# EasyEDA Pro project Dennis_Re.eprj, board PCB1
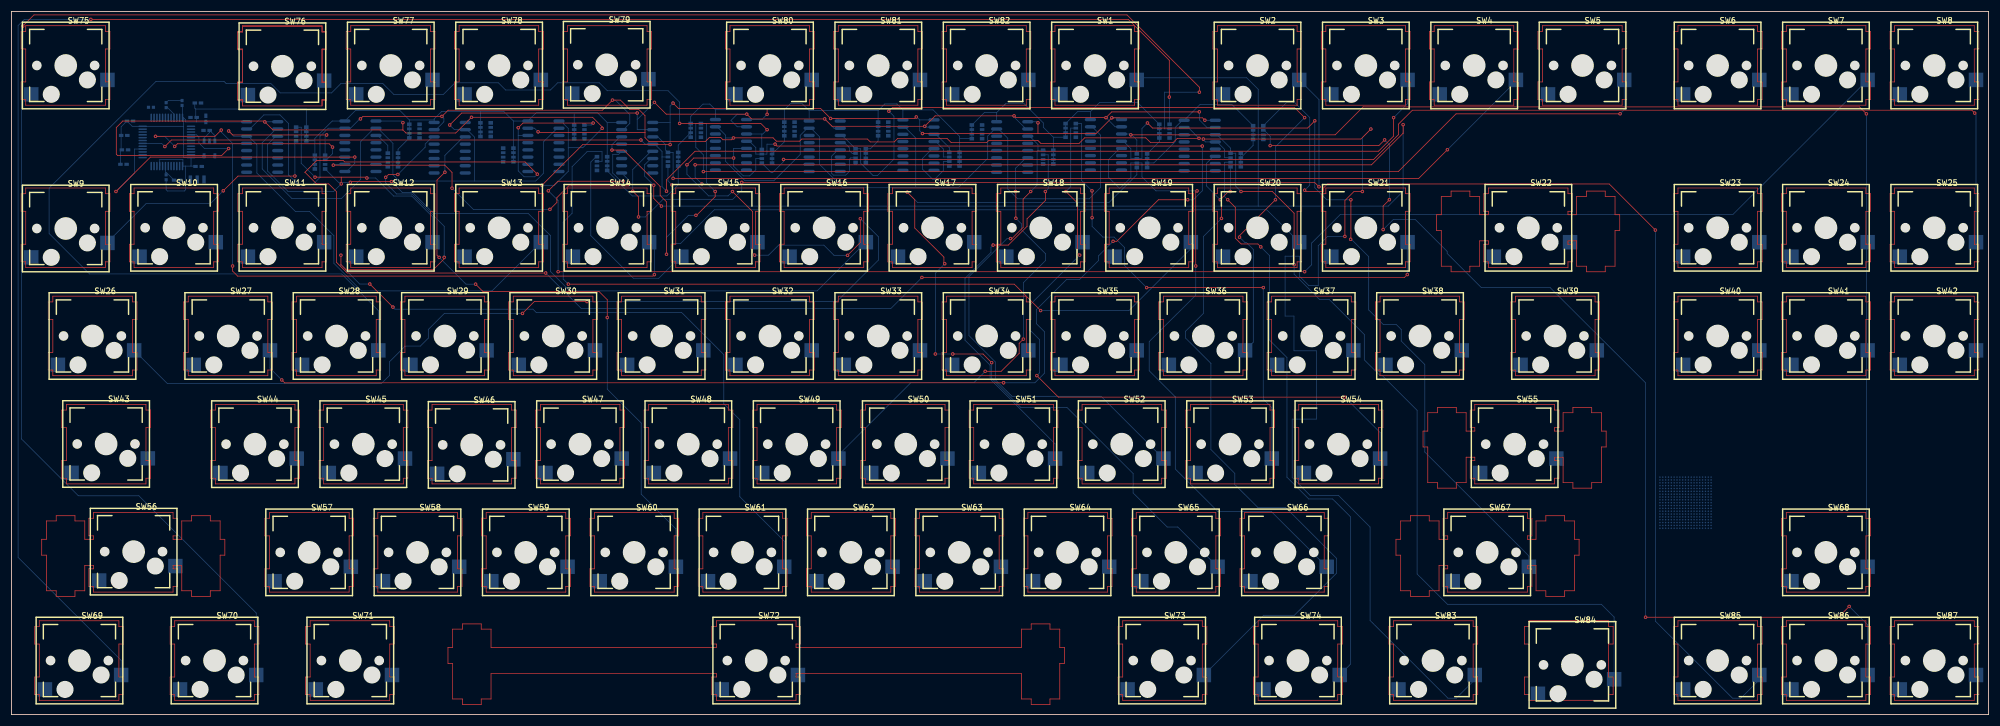
[diagram p3: board, top side]
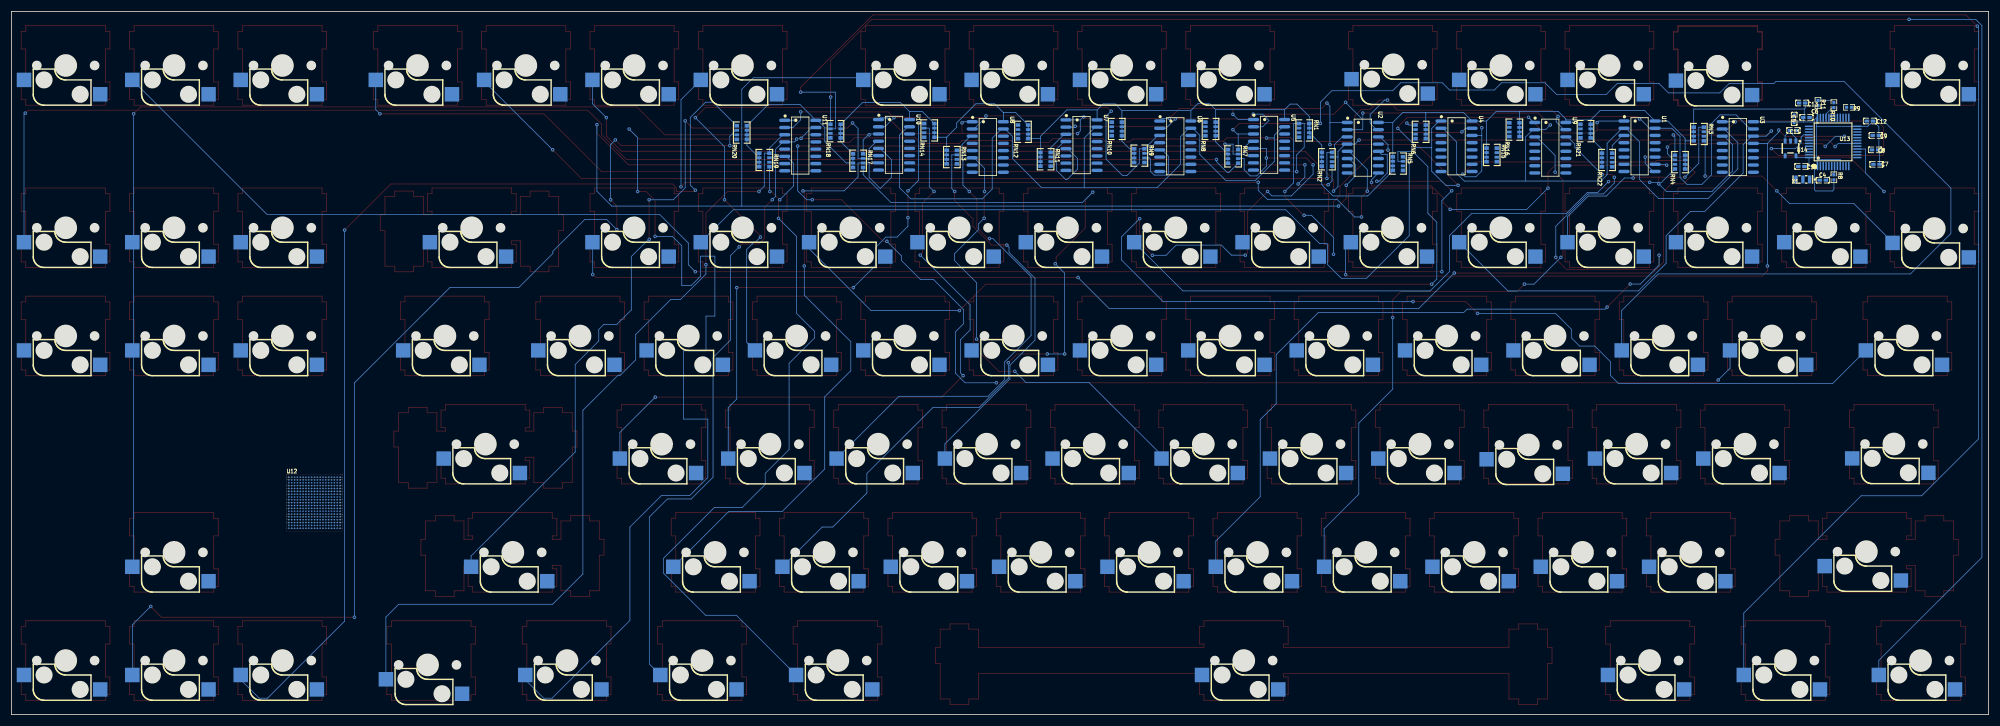
[diagram p4: board, bottom side, seen from below]

Outline 347.66 x 123.83 mm; copper layers: Top Layer, Bottom Layer. Coordinates in mm from the lower left corner of the outline.
Outline path: rectangle 0,123.83 347.66,0
Stack: Top Layer 0.035mm / Dielectric1 1.51mm FR4 er 4.5 / 二层 1.51mm FR4 er 4.5 / 三层 1.51mm FR4 er 4.5 / Bottom Layer 0.035mm

## Design rules (mm)
spacing safeClearance (default): track to track 0.152, other pairs 0.152 to 0.3
track width trackWidth (default): min 0.127, default 0.254, max 2.54
differential pair differentialPair (default): width min 0.127, default 0.254, max 2.54; gap min 0.152, default 0.152
via viaSize (default): diameter min 0.5, default 0.61, max 10; hole min 0.3, default 0.305, max 6

## Placement (name value [footprint] x y rotation side)
C4  100nF  [C0402]  29.15 94.1 180 bottom
C5  100nF  [C0402]  34.2 104.9 270 bottom
C6  100nF  [C0402]  32.04 105.15 0 bottom
C7  100nF  [C0402]  19.72 96.9 180 bottom
C8  100nF  [C0402]  19.97 99.44 180 bottom
C9  10uF  [C0402]  19.84 101.98 180 bottom
C10  100nF  [C0402]  32.92 96.52 180 bottom
C11  10uF  [C0402]  34.32 102.87 180 bottom
C12  10uF  [C0402]  20.86 104.52 180 bottom
C13  100nF  [C0402]  32.8 107.69 180 bottom
R8  10kΩ  [R0402]  27.21 94.61 270 bottom
R9  22Ω  [R0402]  24.54 106.93 180 bottom
R10  22Ω  [R0402]  27.21 107.31 90 bottom
R11  1.5kΩ  [R0402]  30 107.69 270 bottom
RN1  10kΩ  [RES-ARRAY-SMD_0603-8P-L3.2-W1.6-BL]  120.35 102.87 270 bottom
RN2  10kΩ  [RES-ARRAY-SMD_0603-8P-L3.2-W1.6-BL]  116.35 97.79 90 bottom
RN3  10kΩ  [RES-ARRAY-SMD_0603-8P-L3.2-W1.6-BL]  50.96 102.23 270 bottom
RN4  10kΩ  [RES-ARRAY-SMD_0603-8P-L3.2-W1.6-BL]  54.26 97.28 90 bottom
RN5  10kΩ  [RES-ARRAY-SMD_0603-8P-L3.2-W1.6-BL]  103.86 97.02 270 bottom
RN6  10kΩ  [RES-ARRAY-SMD_0603-8P-L3.2-W1.6-BL]  99.86 102.61 90 bottom
RN7  10kΩ  [RES-ARRAY-SMD_0603-8P-L3.2-W1.6-BL]  132.85 98.29 270 bottom
RN8  10kΩ  [RES-ARRAY-SMD_0603-8P-L3.2-W1.6-BL]  136.81 103.12 90 bottom
RN9  10kΩ  [RES-ARRAY-SMD_0603-8P-L3.2-W1.6-BL]  149.34 98.42 270 bottom
RN10  10kΩ  [RES-ARRAY-SMD_0603-8P-L3.2-W1.6-BL]  153.3 103.12 90 bottom
RN11  10kΩ  [RES-ARRAY-SMD_0603-8P-L3.2-W1.6-BL]  165.82 97.79 270 bottom
RN12  10kΩ  [RES-ARRAY-SMD_0603-8P-L3.2-W1.6-BL]  169.78 102.61 90 bottom
RN13  10kΩ  [RES-ARRAY-SMD_0603-8P-L3.2-W1.6-BL]  182.31 98.17 270 bottom
RN14  10kΩ  [RES-ARRAY-SMD_0603-8P-L3.2-W1.6-BL]  186.26 102.87 90 bottom
RN15  10kΩ  [RES-ARRAY-SMD_0603-8P-L3.2-W1.6-BL]  87.38 98.55 270 bottom
RN16  10kΩ  [RES-ARRAY-SMD_0603-8P-L3.2-W1.6-BL]  83.38 102.99 90 bottom
RN17  10kΩ  [RES-ARRAY-SMD_0603-8P-L3.2-W1.6-BL]  198.79 97.53 270 bottom
RN18  10kΩ  [RES-ARRAY-SMD_0603-8P-L3.2-W1.6-BL]  202.75 102.74 90 bottom
RN19  10kΩ  [RES-ARRAY-SMD_0603-8P-L3.2-W1.6-BL]  215.28 97.66 270 bottom
RN20  10kΩ  [RES-ARRAY-SMD_0603-8P-L3.2-W1.6-BL]  219.23 102.49 90 bottom
RN21  10kΩ  [RES-ARRAY-SMD_0603-8P-L3.2-W1.6-BL]  70.87 102.74 90 bottom
RN22  10kΩ  [RES-ARRAY-SMD_0603-8P-L3.2-W1.6-BL]  67.09 97.66 90 bottom
SW1  -  [轴座_焊接热插拔_不带灯]  190.53 114.3 0 top
SW2  -  [轴座_焊接热插拔_不带灯]  219.11 114.3 0 top
SW3  -  [轴座_焊接热插拔_不带灯]  238.16 114.3 0 top
SW4  -  [轴座_焊接热插拔_不带灯]  257.21 114.3 0 top
SW5  -  [轴座_焊接热插拔_不带灯]  276.26 114.3 0 top
SW6  -  [轴座_焊接热插拔_不带灯]  300.01 114.3 0 top
SW7  -  [轴座_焊接热插拔_不带灯]  319.06 114.3 0 top
SW8  -  [轴座_焊接热插拔_不带灯]  338.11 114.3 0 top
SW9  -  [轴座_焊接热插拔_不带灯]  9.56 85.59 0 top
SW10  -  [轴座_焊接热插拔_不带灯]  28.61 85.72 0 top
SW11  -  [轴座_焊接热插拔_不带灯]  47.66 85.72 0 top
SW12  -  [轴座_焊接热插拔_不带灯]  66.71 85.72 0 top
SW13  -  [轴座_焊接热插拔_不带灯]  85.76 85.72 0 top
SW14  -  [轴座_焊接热插拔_不带灯]  104.81 85.72 0 top
SW15  -  [轴座_焊接热插拔_不带灯]  123.86 85.72 0 top
SW16  -  [轴座_焊接热插拔_不带灯]  142.91 85.72 0 top
SW17  -  [轴座_焊接热插拔_不带灯]  161.96 85.72 0 top
SW18  -  [轴座_焊接热插拔_不带灯]  181.01 85.72 0 top
SW19  -  [轴座_焊接热插拔_不带灯]  200.06 85.72 0 top
SW20  -  [轴座_焊接热插拔_不带灯]  219.11 85.72 0 top
SW21  -  [轴座_焊接热插拔_不带灯]  238.16 85.72 0 top
SW22  -  [轴座_焊接热插拔_不带灯]  266.73 85.72 0 top
SW23  -  [轴座_焊接热插拔_不带灯]  300.01 85.72 0 top
SW24  -  [轴座_焊接热插拔_不带灯]  319.06 85.72 0 top
SW25  -  [轴座_焊接热插拔_不带灯]  338.11 85.72 0 top
SW26  -  [轴座_焊接热插拔_不带灯]  14.26 66.67 0 top
SW27  -  [轴座_焊接热插拔_不带灯]  38.13 66.67 0 top
SW28  -  [轴座_焊接热插拔_不带灯]  57.18 66.67 0 top
SW29  -  [轴座_焊接热插拔_不带灯]  76.23 66.67 0 top
SW30  -  [轴座_焊接热插拔_不带灯]  95.28 66.67 0 top
SW31  -  [轴座_焊接热插拔_不带灯]  114.33 66.67 0 top
SW32  -  [轴座_焊接热插拔_不带灯]  133.38 66.67 0 top
SW33  -  [轴座_焊接热插拔_不带灯]  152.43 66.67 0 top
SW34  -  [轴座_焊接热插拔_不带灯]  171.48 66.67 0 top
SW35  -  [轴座_焊接热插拔_不带灯]  190.53 66.67 0 top
SW36  -  [轴座_焊接热插拔_不带灯]  209.58 66.67 0 top
SW37  -  [轴座_焊接热插拔_不带灯]  228.63 66.67 0 top
SW38  -  [轴座_焊接热插拔_不带灯]  247.68 66.67 0 top
SW39  -  [轴座_焊接热插拔_不带灯]  271.43 66.67 0 top
SW40  -  [轴座_焊接热插拔_不带灯]  300.01 66.67 0 top
SW41  -  [轴座_焊接热插拔_不带灯]  319.06 66.67 0 top
SW42  -  [轴座_焊接热插拔_不带灯]  338.11 66.67 0 top
SW43  -  [轴座_焊接热插拔_不带灯]  16.66 47.66 0 top
SW44  -  [轴座_焊接热插拔_不带灯]  42.83 47.62 0 top
SW45  -  [轴座_焊接热插拔_不带灯]  61.88 47.62 0 top
SW46  -  [轴座_焊接热插拔_不带灯]  80.93 47.49 0 top
SW47  -  [轴座_焊接热插拔_不带灯]  99.98 47.62 0 top
SW48  -  [轴座_焊接热插拔_不带灯]  119.03 47.62 0 top
SW49  -  [轴座_焊接热插拔_不带灯]  138.08 47.62 0 top
SW50  -  [轴座_焊接热插拔_不带灯]  157.26 47.62 0 top
SW51  -  [轴座_焊接热插拔_不带灯]  176.18 47.62 0 top
SW52  -  [轴座_焊接热插拔_不带灯]  195.23 47.62 0 top
SW53  -  [轴座_焊接热插拔_不带灯]  214.28 47.62 0 top
SW54  -  [轴座_焊接热插拔_不带灯]  233.33 47.62 0 top
SW55  -  [轴座_焊接热插拔_不带灯]  264.32 47.62 0 top
SW56  -  [轴座_焊接热插拔_不带灯]  21.49 28.7 0 top
SW57  -  [轴座_焊接热插拔_不带灯]  52.36 28.57 0 top
SW58  -  [轴座_焊接热插拔_不带灯]  71.41 28.57 0 top
SW59  -  [轴座_焊接热插拔_不带灯]  90.46 28.57 0 top
SW60  -  [轴座_焊接热插拔_不带灯]  109.51 28.57 0 top
SW61  -  [轴座_焊接热插拔_不带灯]  128.56 28.57 0 top
SW62  -  [轴座_焊接热插拔_不带灯]  147.61 28.57 0 top
SW63  -  [轴座_焊接热插拔_不带灯]  166.66 28.57 0 top
SW64  -  [轴座_焊接热插拔_不带灯]  185.71 28.57 0 top
SW65  -  [轴座_焊接热插拔_不带灯]  204.76 28.57 0 top
SW66  -  [轴座_焊接热插拔_不带灯]  223.93 28.57 0 top
SW67  -  [轴座_焊接热插拔_不带灯]  259.49 28.57 0 top
SW68  -  [轴座_焊接热插拔_不带灯]  319.06 28.57 0 top
SW69  -  [轴座_焊接热插拔_不带灯]  11.97 9.52 0 top
SW70  -  [轴座_焊接热插拔_不带灯]  35.72 9.52 0 top
SW71  -  [轴座_焊接热插拔_不带灯]  59.59 9.52 0 top
SW72  -  [轴座_焊接热插拔_不带灯]  130.97 9.52 0 top
SW73  -  [轴座_焊接热插拔_不带灯]  202.34 9.52 0 top
SW74  -  [轴座_焊接热插拔_不带灯]  226.22 9.52 0 top
SW75  -  [轴座_焊接热插拔_不带灯]  9.56 114.3 0 top
SW76  -  [轴座_焊接热插拔_不带灯]  47.66 114.17 0 top
SW77  -  [轴座_焊接热插拔_不带灯]  66.71 114.3 0 top
SW78  -  [轴座_焊接热插拔_不带灯]  85.76 114.3 0 top
SW79  -  [轴座_焊接热插拔_不带灯]  104.68 114.42 0 top
SW80  -  [轴座_焊接热插拔_不带灯]  133.38 114.3 0 top
SW81  -  [轴座_焊接热插拔_不带灯]  152.43 114.3 0 top
SW82  -  [轴座_焊接热插拔_不带灯]  171.48 114.3 0 top
SW83  -  [轴座_焊接热插拔_不带灯]  249.97 9.52 0 top
SW84  -  [轴座_焊接热插拔_不带灯]  274.48 8.76 0 top
SW85  -  [轴座_焊接热插拔_不带灯]  300.01 9.52 0 top
SW86  -  [轴座_焊接热插拔_不带灯]  319.06 9.52 0 top
SW87  -  [轴座_焊接热插拔_不带灯]  338.11 9.52 0 top
U1  -  [SOIC-16_L9.9-W3.9-P1.27-LS6.0-BL]  61.37 100.07 270 bottom
U2  -  [SOIC-16_L9.9-W3.9-P1.27-LS6.0-BL]  110.04 99.82 270 bottom
U3  -  [SOIC-16_L9.9-W3.9-P1.27-LS6.0-BL]  44.1 99.95 270 bottom
U4  -  [SOIC-16_L9.9-W3.9-P1.27-LS6.0-BL]  93.56 100.07 270 bottom
U5  -  [SOIC-16_L9.9-W3.9-P1.27-LS6.0-BL]  126.52 100.33 270 bottom
U6  -  [SOIC-16_L9.9-W3.9-P1.27-LS6.0-BL]  143.01 100.07 270 bottom
U7  -  [SOIC-16_L9.9-W3.9-P1.27-LS6.0-BL]  159.49 100.27 270 bottom
U8  -  [SOIC-16_L9.9-W3.9-P1.27-LS6.0-BL]  175.98 99.95 270 bottom
U9  -  [SOIC-16_L9.9-W3.9-P1.27-LS6.0-BL]  77.07 99.82 270 bottom
U10  -  [SOIC-16_L9.9-W3.9-P1.27-LS6.0-BL]  192.46 100.33 270 bottom
U11  -  [SOIC-16_L9.9-W3.9-P1.27-LS6.0-BL]  208.95 100.2 270 bottom
U12  VL830  [New_Library:VL830]  294.42 37.59 180 bottom
U13  -  [LQFP-48_L7.0-W7.0-P0.50-LS9.0-BL]  27.34 100.83 180 bottom
U14  -  [SOT-25_L3.0-W1.6-P0.95-LS2.8-BL]  34.83 99.69 0 bottom
X1  8MHz  [OSC-SMD_3P-L3.2-W1.3-P1.20-L]  32.67 94.23 0 bottom

## Footprints (pads in the part's own frame, mm; a bottom-side part is the same pattern mirrored in y, then rotated)
C0402
  rect 0.79x0.54 smd: 1(-0.545,0) 2(0.545,0)
LQFP-48_L7.0-W7.0-P0.50-LS9.0-BL
  oval 0.27x1.5 smd: 1(-2.75,-4.25) 2(-2.25,-4.25) 3(-1.75,-4.25) 4(-1.25,-4.25) 5(-0.75,-4.25) 6(-0.25,-4.25) 7(0.25,-4.25) 8(0.75,-4.25) 9(1.25,-4.25) 10(1.75,-4.25) 11(2.25,-4.25) 12(2.75,-4.25) 25(2.75,4.25) 26(2.25,4.25) 27(1.75,4.25) 28(1.25,4.25) 29(0.75,4.25) 30(0.25,4.25) 31(-0.25,4.25) 32(-0.75,4.25) 33(-1.25,4.25) 34(-1.75,4.25) 35(-2.25,4.25) 36(-2.75,4.25)
  oval 1.5x0.27 smd: 13(4.25,-2.75) 14(4.25,-2.25) 15(4.25,-1.75) 16(4.25,-1.25) 17(4.25,-0.75) 18(4.25,-0.25) 19(4.25,0.25) 20(4.25,0.75) 21(4.25,1.25) 22(4.25,1.75) 23(4.25,2.25) 24(4.25,2.75) 37(-4.25,2.75) 38(-4.25,2.25) 39(-4.25,1.75) 40(-4.25,1.25) 41(-4.25,0.75) 42(-4.25,0.25) 43(-4.25,-0.25) 44(-4.25,-0.75) 45(-4.25,-1.25) 46(-4.25,-1.75) 47(-4.25,-2.25) 48(-4.25,-2.75)
New_Library:VL830
  round 0.27 smd: 1(-4.45,4.23) 2(-3.95,4.23) 3(-3.45,4.23) 4(-2.95,4.23) 5(-2.45,4.23) 6(-1.95,4.23) 7(-1.45,4.23) 8(-0.95,4.23) 9(-0.45,4.23) 10(0.06,4.23) 11(0.55,4.23) 12(1.05,4.23) 13(1.55,4.23) 14(2.05,4.23) 15(2.55,4.23) 16(3.05,4.23) 17(3.55,4.23) 18(4.05,4.23) 19(4.55,4.23) 20(-4.45,3.73) 21(-3.95,3.73) 22(-3.45,3.73) 23(-2.95,3.73) 24(-2.45,3.73) 25(-1.95,3.73) 26(-1.45,3.73) 27(-0.95,3.73) 28(-0.45,3.73) 29(0.06,3.73) 30(0.55,3.73) 31(1.05,3.73) 32(1.55,3.73) 33(2.05,3.73) 34(2.55,3.73) 35(3.05,3.73) 36(3.55,3.73) 37(4.05,3.73) 38(4.55,3.73) 39(-4.45,3.23) 40(-3.95,3.23) 41(-3.45,3.23) 42(-2.95,3.23) 43(-2.45,3.23) 44(-1.95,3.23) 45(-1.45,3.23) 46(-0.95,3.23) 47(-0.45,3.23) 48(0.06,3.23) 49(0.55,3.23) 50(1.05,3.23) 51(1.55,3.23) 52(2.05,3.23) 53(2.55,3.23) 54(3.05,3.23) 55(3.55,3.23) 56(4.05,3.23) 57(4.55,3.23) 58(-4.45,2.73) 59(-3.95,2.73) 60(-3.45,2.73) 61(-2.95,2.73) 62(-2.45,2.73) 63(-1.95,2.73) 64(-1.45,2.73) 65(-0.95,2.73) 66(-0.45,2.73) 67(0.06,2.73) 68(0.55,2.73) 69(1.05,2.73) 70(1.55,2.73) 71(2.05,2.73) 72(2.55,2.73) 73(3.05,2.73) 74(3.55,2.73) 75(4.05,2.73) 76(4.55,2.73) 77(-4.45,2.23) 78(-3.95,2.23) 79(-3.45,2.23) 80(-2.95,2.23) 81(-2.45,2.23) 82(-1.95,2.23) 83(-1.45,2.23) 84(-0.95,2.23) 85(-0.45,2.23) 86(0.06,2.23) 87(0.55,2.23) 88(1.05,2.23) 89(1.55,2.23) 90(2.05,2.23) 91(2.55,2.23) 92(3.05,2.23) 93(3.55,2.23) 94(4.05,2.23) 95(4.55,2.23) 96(-4.45,1.73) 97(-3.95,1.73) 98(-3.45,1.73) 99(-2.95,1.73) 100(-2.45,1.73) 101(-1.95,1.73) 102(-1.45,1.73) 103(-0.95,1.73) 104(-0.45,1.73) 105(0.06,1.73) 106(0.55,1.73) 107(1.05,1.73) 108(1.55,1.73) 109(2.05,1.73) 110(2.55,1.73) 111(3.05,1.73) 112(3.55,1.73) 113(4.05,1.73) 114(4.55,1.73) 115(-4.45,1.23) 116(-3.95,1.23) 117(-3.45,1.23) 118(-2.95,1.23) 119(-2.45,1.23) 120(-1.95,1.23) 121(-1.45,1.23) 122(-0.95,1.23) 123(-0.45,1.23) 124(0.06,1.23) 125(0.55,1.23) 126(1.05,1.23) 127(1.55,1.23) 128(2.05,1.23) 129(2.55,1.23) 130(3.05,1.23) 131(3.55,1.23) 132(4.05,1.23) 133(4.55,1.23) 134(-4.45,0.73) 135(-3.95,0.73) 136(-3.45,0.73) 137(-2.95,0.73) 138(-2.45,0.73) 139(-1.95,0.73) 140(-1.45,0.73) 141(-0.95,0.73) 142(-0.45,0.73) 143(0.06,0.73) 144(0.55,0.73) 145(1.05,0.73) 146(1.55,0.73) 147(2.05,0.73) 148(2.55,0.73) 149(3.05,0.73) 150(3.55,0.73) 151(4.05,0.73) 152(4.55,0.73) 153(-4.45,0.23) 154(-3.95,0.23) 155(-3.45,0.23) 156(-2.95,0.23) 157(-2.45,0.23) 158(-1.95,0.23) 159(-1.45,0.23) 160(-0.95,0.23) 161(-0.45,0.23) 162(0.06,0.23) 163(0.55,0.23) 164(1.05,0.23) 165(1.55,0.23) 166(2.05,0.23) 167(2.55,0.23) 168(3.05,0.23) 169(3.55,0.23) 170(4.05,0.23) 171(4.55,0.23) 172(-4.45,-0.27) 173(-3.95,-0.27) 174(-3.45,-0.27) 175(-2.95,-0.27) 176(-2.45,-0.27) 177(-1.95,-0.27) 178(-1.45,-0.27) 179(-0.95,-0.27) 180(-0.45,-0.27) 181(0.06,-0.27) 182(0.55,-0.27) 183(1.05,-0.27) 184(1.55,-0.27) 185(2.05,-0.27) 186(2.55,-0.27) 187(3.05,-0.27) 188(3.55,-0.27) 189(4.05,-0.27) 190(4.55,-0.27) 191(-4.45,-0.77) 192(-3.95,-0.77) 193(-3.45,-0.77) 194(-2.95,-0.77) 195(-2.45,-0.77) 196(-1.95,-0.77) 197(-1.45,-0.77) 198(-0.95,-0.77) 199(-0.45,-0.77) 200(0.06,-0.77) 201(0.55,-0.77) 202(1.05,-0.77) 203(1.55,-0.77) 204(2.05,-0.77) 205(2.55,-0.77) 206(3.05,-0.77) 207(3.55,-0.77) 208(4.05,-0.77) 209(4.55,-0.77) 210(-4.45,-1.27) 211(-3.95,-1.27) 212(-3.45,-1.27) 213(-2.95,-1.27) 214(-2.45,-1.27) 215(-1.95,-1.27) 216(-1.45,-1.27) 217(-0.95,-1.27) 218(-0.45,-1.27) 219(0.06,-1.27) 220(0.55,-1.27) 221(1.05,-1.27) 222(1.55,-1.27) 223(2.05,-1.27) 224(2.55,-1.27) 225(3.05,-1.27) 226(3.55,-1.27) 227(4.05,-1.27) 228(4.55,-1.27) 229(-4.45,-1.77) 230(-3.95,-1.77) 231(-3.45,-1.77) 232(-2.95,-1.77) 233(-2.45,-1.77) 234(-1.95,-1.77) 235(-1.45,-1.77) 236(-0.95,-1.77) 237(-0.45,-1.77) 238(0.06,-1.77) 239(0.55,-1.77) 240(1.05,-1.77) 241(1.55,-1.77) 242(2.05,-1.77) 243(2.55,-1.77) 244(3.05,-1.77) 245(3.55,-1.77) 246(4.05,-1.77) 247(4.55,-1.77) 248(-4.45,-2.27) 249(-3.95,-2.27) 250(-3.45,-2.27) 251(-2.95,-2.27) 252(-2.45,-2.27) 253(-1.95,-2.27) 254(-1.45,-2.27) 255(-0.95,-2.27) 256(-0.45,-2.27) 257(0.06,-2.27) 258(0.55,-2.27) 259(1.05,-2.27) 260(1.55,-2.27) 261(2.05,-2.27) 262(2.55,-2.27) 263(3.05,-2.27) 264(3.55,-2.27) 265(4.05,-2.27) 266(4.55,-2.27) 267(-4.45,-2.77) 268(-3.95,-2.77) 269(-3.45,-2.77) 270(-2.95,-2.77) 271(-2.45,-2.77) 272(-1.95,-2.77) 273(-1.45,-2.77) 274(-0.95,-2.77) 275(-0.45,-2.77) 276(0.06,-2.77) 277(0.55,-2.77) 278(1.05,-2.77) 279(1.55,-2.77) 280(2.05,-2.77) 281(2.55,-2.77) 282(3.05,-2.77) 283(3.55,-2.77) 284(4.05,-2.77) 285(4.55,-2.77) 286(-4.45,-3.27) 287(-3.95,-3.27) 288(-3.45,-3.27) 289(-2.95,-3.27) 290(-2.45,-3.27) 291(-1.95,-3.27) 292(-1.45,-3.27) 293(-0.95,-3.27) 294(-0.45,-3.27) 295(0.06,-3.27) 296(0.55,-3.27) 297(1.05,-3.27) 298(1.55,-3.27) 299(2.05,-3.27) 300(2.55,-3.27) 301(3.05,-3.27) 302(3.55,-3.27) 303(4.05,-3.27) 304(4.55,-3.27) 305(-4.45,-3.77) 306(-3.95,-3.77) 307(-3.45,-3.77) 308(-2.95,-3.77) 309(-2.45,-3.77) 310(-1.95,-3.77) 311(-1.45,-3.77) 312(-0.95,-3.77) 313(-0.45,-3.77) 314(0.06,-3.77) 315(0.55,-3.77) 316(1.05,-3.77) 317(1.55,-3.77) 318(2.05,-3.77) 319(2.55,-3.77) 320(3.05,-3.77) 321(3.55,-3.77) 322(4.05,-3.77) 323(4.55,-3.77) 324(-4.45,-4.27) 325(-3.95,-4.27) 326(-3.45,-4.27) 327(-2.95,-4.27) 328(-2.45,-4.27) 329(-1.95,-4.27) 330(-1.45,-4.27) 331(-0.95,-4.27) 332(-0.45,-4.27) 333(0.06,-4.27) 334(0.55,-4.27) 335(1.05,-4.27) 336(1.55,-4.27) 337(2.05,-4.27) 338(2.55,-4.27) 339(3.05,-4.27) 340(3.55,-4.27) 341(4.05,-4.27) 342(4.55,-4.27) 343(-4.45,-4.77) 344(-3.95,-4.77) 345(-3.45,-4.77) 346(-2.95,-4.77) 347(-2.45,-4.77) 348(-1.95,-4.77) 349(-1.45,-4.77) 350(-0.95,-4.77) 351(-0.45,-4.77) 352(0.06,-4.77) 353(0.55,-4.77) 354(1.05,-4.77) 355(1.55,-4.77) 356(2.05,-4.77) 357(2.55,-4.77) 358(3.05,-4.77) 359(3.55,-4.77) 360(4.05,-4.77) 361(4.55,-4.77)
OSC-SMD_3P-L3.2-W1.3-P1.20-L
  rect 0.6x1.399 smd: 1(-1.199,0) 2(0,0) 3(1.199,0)
R0402
  rect 0.566x0.54 smd: 1(-0.433,0) 2(0.433,0)
RES-ARRAY-SMD_0603-8P-L3.2-W1.6-BL
  rect 0.65x0.8 smd: 1(-1.2,-0.9) 4(1.2,-0.9) 5(1.2,0.9) 8(-1.2,0.9)
  rect 0.5x0.8 smd: 2(-0.4,-0.9) 3(0.4,-0.9) 6(0.4,0.9) 7(-0.4,0.9)
SOIC-16_L9.9-W3.9-P1.27-LS6.0-BL
  oval 0.602x1.971 smd: 1(-4.445,-2.736) 2(-3.175,-2.736) 3(-1.905,-2.736) 4(-0.635,-2.736) 5(0.635,-2.736) 6(1.905,-2.736) 7(3.175,-2.736) 8(4.445,-2.736) 9(4.445,2.736) 10(3.175,2.736) 11(1.905,2.736) 12(0.635,2.736) 13(-0.635,2.736) 14(-1.905,2.736) 15(-3.175,2.736) 16(-4.445,2.736)
SOT-25_L3.0-W1.6-P0.95-LS2.8-BL
  rect 0.5x0.899 smd: 1(-0.95,-1.3) 2(0,-1.3) 3(0.95,-1.3) 4(0.95,1.3) 5(-0.95,1.3)
轴座_焊接热插拔_不带灯
  rect 2.55x2.55 smd far side: 1(-6.066,-5.08) 2(7.335,-2.54)

## Nets
As in the schematic.

Pads without a net: U1 7; U2 7; U3 7; U4 7; U5 7; U6 7; U7 7; U8 7; U9 7; U10 7; U11 7 10; U12 1 2 3 4 5 6 7 8 9 10 11 12 13 14 15 16 17 18 19 20 21 22 23 24 25 26 27 28 29 30 31 32 33 34 35 36 37 38 39 40 41 42 43 44 45 46 47 48 49 50 51 52 53 54 55 56 57 58 59 60 61 62 63 64 65 66 67 68 69 70 71 72 73 74 75 76 77 78 79 80 81 82 83 84 85 86 87 88 89 90 91 92 93 94 95 96 97 98 99 100 101 102 103 104 105 106 107 108 109 110 111 112 113 114 115 116 117 118 119 120 121 122 123 124 125 126 127 128 129 130 131 132 133 134 135 136 137 138 139 140 141 142 143 144 145 146 147 148 149 150 151 152 153 154 155 156 157 158 159 160 161 162 163 164 165 166 167 168 169 170 171 172 173 174 175 176 177 178 179 180 181 182 183 184 185 186 187 188 189 190 191 192 193 194 195 196 197 198 199 200 201 202 203 204 205 206 207 208 209 210 211 212 213 214 215 216 217 218 219 220 221 222 223 224 225 226 227 228 229 230 231 232 233 234 235 236 237 238 239 240 241 242 243 244 245 246 247 248 249 250 251 252 253 254 255 256 257 258 259 260 261 262 263 264 265 266 267 268 269 270 271 272 273 274 275 276 277 278 279 280 281 282 283 284 285 286 287 288 289 290 291 292 293 294 295 296 297 298 299 300 301 302 303 304 305 306 307 308 309 310 311 312 313 314 315 316 317 318 319 320 321 322 323 324 325 326 327 328 329 330 331 332 333 334 335 336 337 338 339 340 341 342 343 344 345 346 347 348 349 350 351 352 353 354 355 356 357 358 359 360 361; U13 2 3 4 10 11 12 13 14 17 19 20 21 22 25 27 29 38 41 42 43 45 46; U14 4

## Via types
v1: diameter 0.61, hole 0.305, Top Layer to Bottom Layer, 169 vias

## Routing (per net, layer and track width the routed paths; a pad name or vN(x,y) marks a point on that pad's centre or on a via; arc(x,y) is an arc through that point)
VCC_3V3: length 404.1
  Bottom Layer w0.127: 30.16,96.58 30.63,96.58 ; 30.16,96.58 30.09,96.58 ; 30.16,96.58 30.16,97.76 26.09,97.76 26.09,96.58 ; 30.63,96.58 30.63,92.42 30.41,92.2 27.43,92.2 27.21,92.42 R8.2 ; 30.63,96.58 31.59,96.58 ; U9.16 74.33,104.7 ; 74.33,104.7 74.33,104.88 75.68,106.22 82.45,106.22 82.48,106.2 ; 74.33,104.7 69.97,104.7 ; RN19.2 RN19.1 ; RN19.2 218.33,100.22 RN20.1 RN20.2 RN20.3 RN20.4 214.58,107.44 209.01,107.44 U11.16 205.89,104.64 204.64,103.39 204.64,100.89 200.88,97.13 RN17.3 ; RN19.2 RN19.4 ; 31.59,98.08 30.29,98.08 30.29,103.58 ; 31.59,98.08 33.57,98.08 U14.5 ; 31.59,98.08 31.59,96.58 ; RN9.4 RN9.2 RN9.1 151.04,99.62 152.4,100.98 RN10.1 RN10.2 RN10.3 RN10.4 152.4,106.35 ; RN7.4 RN7.3 RN7.2 ; 183.21,101.67 RN14.1 RN14.2 RN14.3 RN14.4 187.46,106.17 189.73,106.17 ; 183.21,101.67 181.45,103.43 181.45,104.18 178.07,107.55 174.79,107.55 173.24,106.01 ; 183.21,101.67 RN13.2 183.21,96.97 ; 135.91,106.51 RN8.4 RN8.3 RN8.2 RN8.1 135.91,100.85 RN7.2 ; 135.91,106.51 123.79,106.51 ; 135.91,106.51 136.97,107.56 139.06,107.56 140.27,106.35 ; 32.41,106.63 32.25,106.79 C13.2 ; 32.41,106.63 32.41,105.32 C6.2 32.58,104.35 ; 32.41,106.63 51.86,106.63 RN3.1 RN3.2 RN3.3 RN3.4 53.36,101.03 ; RN17.3 RN17.4 ; RN17.3 RN17.2 RN17.1 201.85,100.89 RN18.1 RN18.2 RN18.3 RN18.4 198.01,107.78 191.34,107.78 189.73,106.17 ; 189.73,106.17 U10.16 ; 88.28,104.52 U4.16 92.34,106.04 98.96,106.04 ; 88.28,104.52 86.6,106.2 82.48,106.2 ; 88.28,104.52 RN15.1 RN15.2 RN15.3 RN15.4 ; RN1.6 RN1.7 RN1.8 119.45,105.33 121.62,107.5 122.8,107.5 123.79,106.51 ; RN1.6 117.25,100.27 RN2.5 RN2.6 RN2.7 RN2.8 117.25,93.31 115.27,91.32 109.18,91.32 104.76,95.74 RN5.4 RN5.3 RN5.2 RN5.1 104.76,104.26 ; RN1.6 RN1.5 ; 69.97,104.7 RN21.4 RN21.3 RN21.2 RN21.1 67.99,99.56 RN22.5 RN22.6 RN22.8 ; 69.97,104.7 68.33,106.35 60.47,106.35 U1.16 56.42,104.52 53.36,101.46 53.36,101.03 ; 156.76,106.48 155.71,107.53 153.58,107.53 152.4,106.35 ; 156.76,106.48 162.06,106.48 166.72,101.82 166.72,101.41 ; 156.76,106.48 U7.16 ; 123.79,106.51 U5.16 ; 32.58,104.35 30.66,104.35 30.66,104.72 30.29,105.08 ; 32.58,104.35 C5.2 41.33,104.35 U3.16 ; 30.29,103.58 U13.24 21.25,103.58 C12.2 19.3,103.5 C9.2 19.3,99.44 ; 30.29,103.58 30.29,105.08 U13.36 30.09,107.18 R11.2 ; 166.72,101.41 RN12.1 RN12.2 RN12.3 RN12.4 171.07,106.01 173.24,106.01 ; 166.72,101.41 RN11.1 RN11.2 RN11.3 RN11.4 ; 104.76,104.26 102.98,106.04 98.96,106.04 ; 104.76,104.26 U2.16 ; 31.59,96.58 32.31,96.58 C10.2 ; 53.36,101.03 RN4.4 RN4.3 RN4.2 RN4.1 ; 173.24,106.01 U8.16 ; RN6.1 RN6.2 RN6.3 RN6.4 98.96,106.04 ; 140.27,106.35 152.4,106.35 ; 140.27,106.35 U6.16 ; 82.48,106.2 RN16.3 RN16.2 RN16.1 ; RN7.2 RN7.1 ; 19.3,99.44 19.17,99.31 C7.2 ; 19.3,99.44 C8.2
VCC_BAT: length 4.5
  Bottom Layer w0.127: U14.1 33.88,101.53 34.87,102.51 C11.1 35.78,101.95 U14.3
FN_KEY: length 245.2
  Top Layer w0.127: v1(243.04,105.11) 243.04,101.87 240.37,99.2 120.21,99.2 115.19,94.18 v1(115.19,92.16) ; v1(26.99,100.02) 28.15,101.18 v1(110.7,101.18)
  Bottom Layer w0.127: U13.18 26.43,100.58 v1(26.99,100.02) ; v1(243.04,105.11) 245.49,107.56 SW3.2 ; 114.4,98.19 114.4,99.15 113.1,100.45 U2.4 111.42,100.45 v1(110.7,101.18) ; 114.4,98.19 114.4,92.95 v1(115.19,92.16) ; 114.4,98.19 RN2.3
NRST: length 3.6
  Bottom Layer w0.127: 27.21,95.41 R8.1 ; 27.21,95.41 27.3,95.41 C4.2 ; 27.21,95.41 27.09,95.41 27.09,96.58
SCAN_CE: length 362.9
  Top Layer w0.127: v1(208.82,101.47) 205.01,101.47 204.25,100.71 200.31,100.71 199.46,101.56 188.72,101.56 187.74,100.58 181.01,100.58 180.5,101.09 171.86,101.09 171.48,100.71 165.26,100.71 164.5,101.47 155.86,101.47 155.23,100.83 151.03,100.83 150.53,101.34 138.97,101.34 138.59,100.97 134.52,100.97 133.92,101.56 126.99,101.56 v1(126.96,101.53) 126.64,101.22 125.13,101.22 124.75,101.6 122.71,101.6 122,100.89 112.12,100.89 111.41,101.6 111.41,102.49 ; v1(92.61,102.61) 92.74,102.49 111.41,102.49 ; 111.41,102.49 111.41,105.47 110.33,106.55 108.74,106.55 107.09,108.2 v1(105.7,108.2) 103.92,106.42 76.8,106.42 v1(75.7,105.33) 61.82,105.33 v1(61.37,104.88)
  Bottom Layer w0.127: 125.59,101.53 125.59,102.03 124.11,103.5 U5.15 ; 125.59,101.53 125.59,97.41 128.98,94.01 134.08,94.01 138.7,98.63 138.7,101.99 139.95,103.25 U6.15 140.6,103.25 142.07,101.77 142.07,96.91 146.21,92.77 159.02,92.77 ; 125.59,101.53 v1(126.96,101.53) ; 156.76,103.45 157.08,103.45 159.02,101.51 159.02,92.77 ; 159.02,92.77 166.49,92.77 171.67,97.95 171.67,101.87 172.92,103.12 U8.15 173.56,103.12 175.2,101.48 175.2,92.54 176.93,90.81 189.52,90.81 191.53,92.82 191.53,102.03 190.05,103.5 U10.15 ; v1(61.37,104.88) 61.25,104.88 59.62,103.25 U1.15 55.71,103.25 54.26,101.8 54.26,94.58 53.06,93.38 50.38,93.38 48.74,95.02 48.74,104.08 47.22,105.6 44.4,105.6 41.92,103.12 U3.15 ; U2.15 107.63,102.99 108.74,104.11 108.74,105.66 106.2,108.2 v1(105.7,108.2) ; v1(92.61,102.61) 91.98,103.25 U4.15 ; v1(75.7,105.33) 76.04,104.99 76.04,104.38 74.66,102.99 U9.15 ; U11.15 206.92,103.37 v1(208.82,101.47)
SCAN_PL: length 306.2
  Top Layer w0.127: v1(93.28,93.2) 100.45,100.37 v1(115.83,100.37) ; 68.84,102.94 v1(68.84,104.23) ; 68.84,102.94 69.38,102.41 78.13,102.41 v1(80.9,105.18) 102.19,105.18 103.88,103.49 v1(103.88,103.23) ; 68.84,102.94 45.99,102.94 v1(44.57,104.36) 44.41,104.52 19.59,104.52 18.45,103.37 18.45,98.68 18.68,98.45 36.98,98.45 v1(38.2,99.67) ; 180.51,102.31 v1(180.51,104.2) ; 180.51,102.31 v1(160.2,102.31) ; 180.51,102.31 190.72,102.31 v1(193.49,105.08) 209.43,105.08 v1(209.85,104.66) ; v1(116.35,107.67) 117.28,106.74 132.88,106.74 ; v1(159.11,105.23) 158.85,104.97 v1(144.04,104.97) 142.27,106.74 132.88,106.74 ; 132.88,106.74 v1(132.88,105.7)
  Bottom Layer w0.127: 115.83,104.26 115.83,107.15 v1(116.35,107.67) ; 115.83,104.26 U2.1 ; 115.83,104.26 v1(115.83,100.37) ; v1(80.9,105.18) 79.98,104.26 U9.1 ; v1(209.85,104.66) 209.87,104.64 U11.1 ; v1(103.88,103.23) 100.47,99.82 97.92,99.82 ; v1(159.11,105.23) 159.2,105.23 159.72,104.72 ; v1(160.2,102.31) 159.72,102.78 159.72,104.72 ; v1(144.04,104.97) 145.29,104.97 145.75,104.52 ; v1(193.49,105.08) 194.89,105.08 U10.1 ; v1(93.28,93.2) 95.45,93.2 97.92,95.66 97.92,99.82 ; 159.72,104.72 U7.1 ; U1.1 68.56,104.52 v1(68.84,104.23) ; v1(44.57,104.36) 44.6,104.39 U3.1 ; 178.72,104.39 180.32,104.39 v1(180.51,104.2) ; 97.92,99.82 97.92,103.21 96.61,104.52 U4.1 ; v1(38.2,99.67) 33.96,99.67 32.97,100.66 32.97,101.67 32.56,102.08 U13.40 ; v1(132.88,105.7) 131.95,104.77 U5.1
SPI1_CLK: length 264.7
  Top Layer w0.127: v1(77.07,103.82) 79.17,105.92 v1(110.04,105.92) ; v1(208.88,106.13) 193.48,106.13 v1(192.46,105.11) 176.62,105.11 v1(176.3,105.42) 162.43,105.42 v1(160.6,103.59) 144.3,103.59 v1(143.01,104.88) 130.15,104.88 v1(129.31,105.73) 115.14,105.73 v1(113.07,107.8)
  Bottom Layer w0.127: 81.44,93.95 92.19,93.95 93.56,95.32 93.56,100.83 95.97,103.25 U4.2 ; 81.44,93.95 81.44,101.69 80.13,102.99 U9.2 77.9,102.99 v1(77.07,103.82) ; 81.44,93.95 68.2,93.95 67.09,95.06 67.09,100.59 64.43,103.25 U1.2 63.79,103.25 61.37,100.83 61.37,94.22 58.03,90.88 49.31,90.88 44.1,96.09 44.1,100.71 46.52,103.12 U3.2 ; 162.23,103.45 160.75,103.45 v1(160.6,103.59) ; 110.04,104.77 v1(113.07,107.8) ; 110.04,104.77 110.04,102.99 U2.2 ; 110.04,104.77 v1(110.04,105.92) ; v1(129.31,105.73) 127.64,105.73 126.52,104.61 127.64,103.5 U5.2 ; U10.2 194.08,103.5 v1(192.46,105.11) ; U11.2 210.23,103.37 208.88,104.72 v1(208.88,106.13) ; 178.72,103.12 178.39,103.12 176.3,105.21 v1(176.3,105.42) ; v1(143.01,104.88) 144.65,103.25 145.75,103.25
SPI1_MISO: length 58.2
  Top Layer w0.127: v1(60.38,98.17) 24.45,98.17 v1(18.39,92.11)
  Bottom Layer w0.127: U13.16 21.63,99.58 21.63,95.35 v1(18.39,92.11) ; v1(60.38,98.17) 60.38,97.05 58.96,95.63 U1.9
USB_D_P: length 2.5
  Bottom Layer w0.127: U13.33 28.59,105.76 27.46,106.88 R10.1
USB_PORT_P: length 3
  Bottom Layer w0.127: R11.1 27.59,108.13 R10.2
$3N18307: length 337.6
  Top Layer w0.127: v1(120.23,96.81) 239.15,96.81 244.71,102.37 v1(244.71,103.88) ; v1(116.14,93.29) 121.28,93.29 v1(121.42,93.43) ; v1(114.3,89.54) 112.95,90.89 v1(112.95,93.21)
  Bottom Layer w0.127: v1(114.3,89.54) 219.23,89.54 ; 219.23,89.54 242.09,89.54 244.71,92.16 v1(244.71,103.88) ; 219.23,89.54 219.23,110.11 217.2,112.14 198.25,112.14 SW1.2 ; U2.6 112.45,97.91 111.35,96.81 111.35,94.81 v1(112.95,93.21) ; v1(121.42,93.43) 120.23,94.62 v1(120.23,96.81) ; RN2.1 115.45,93.98 v1(116.14,93.29)
$3N18308: length 157.2
  Top Layer w0.127: v1(109.25,92.16) 110.27,91.15 v1(110.27,87.63) ; v1(229.92,92.93) 229.13,93.72 v1(128.43,93.72)
  Bottom Layer w0.127: v1(128.43,93.72) 128.43,92.33 126.83,90.73 114.58,90.73 111.47,87.63 v1(110.27,87.63) ; v1(109.25,92.16) 109.25,95.98 112.45,99.18 U2.5 ; v1(229.92,92.93) 229.92,108.28 SW2.2
$3N18310: length 165.4
  Top Layer w0.127: v1(116.35,94.42) 247.46,94.42 v1(252.49,99.46)
  Bottom Layer w0.127: SW4.2 264.54,111.5 v1(252.49,99.46) ; U2.3 113.66,101.72 115.03,100.35 115.03,99.41 RN2.4 116.35,98.99 v1(116.35,94.42)
$3N18312: length 237.3
  Top Layer w0.127: v1(123.75,92.11) 123.75,91.2 120.47,87.92 v1(120.37,87.92) ; v1(105.6,99.41) 107.67,99.41 114.07,93.01 114.07,91.41 115.19,90.29 v1(115.19,81.06) ; v1(282.86,105.79) 254.03,105.79 243.85,95.61 v1(121.67,95.61)
  Bottom Layer w0.127: v1(120.37,87.92) 119.07,87.92 115.19,84.04 v1(115.19,81.06) ; U2.14 106.98,101.72 105.6,100.34 v1(105.6,99.41) ; v1(282.86,105.79) 283.59,106.52 SW5.2 ; v1(121.67,95.61) 121.67,98.57 120.35,99.89 120.35,104.07 RN1.1 122.22,104.07 122.22,93.63 v1(123.75,92.11)
$3N18314: length 282.8
  Top Layer w0.127: v1(227.4,77.98) v1(96.14,77.98) ; v1(107.57,93.92) 96.1,93.92 v1(94.41,92.23)
  Bottom Layer w0.127: v1(227.4,77.98) 228.63,79.22 228.63,83.04 233.69,88.09 302.72,88.09 SW7.2 ; v1(96.14,77.98) 96.14,90.51 v1(94.41,92.23) ; U2.12 106.78,98.66 105.74,98.66 105.74,95.35 107.17,93.92 v1(107.57,93.92)
$3N18320: length 242.8
  Top Layer w0.127: v1(345.22,105.91) 344.71,106.42 246.34,106.42 243.88,103.96 243.88,102.09 239.53,97.75 v1(135.77,97.75)
  Bottom Layer w0.127: v1(135.77,97.75) 135.77,97.36 133.86,95.45 133.59,95.45 RN7.5 ; v1(345.22,105.91) 345.44,105.69 SW25.2
$3N18321: length 224.9
  Top Layer w0.127: v1(126.99,98) 119.98,98 v1(118.78,96.81) ; v1(101.21,72.73) 91.95,72.73 v1(89.87,70.64) ; v1(130.69,80.9) 130.31,81.29 130.31,88.58 v1(126.79,92.11) ; v1(147.03,80.87) 149.27,83.12 v1(149.27,87.32)
  Bottom Layer w0.127: v1(118.78,96.81) 118.78,95.15 122.6,91.33 126.01,91.33 v1(126.79,92.11) ; v1(101.21,72.73) 145.15,72.73 152.44,80.03 152.44,84.15 v1(149.27,87.32) ; U5.5 126.99,99.69 v1(126.99,98) 126.99,96.56 128.69,94.86 129.83,94.86 130.9,95.93 130.9,97.89 RN7.6 ; v1(89.87,70.64) 76.14,70.64 73.31,67.81 73.31,66.29 71.91,64.89 69.25,64.89 66.5,62.15 66.5,59.74 65.06,58.29 27.43,58.29 21.59,64.13 ; v1(130.69,80.9) 133.14,80.9 134.9,82.66 142.85,82.66 144.64,80.87 v1(147.03,80.87)
$3N18322: length 282.7
  Top Layer w0.127: v1(47.55,58.93) 48.05,58.43 v1(174.47,58.43) ; v1(209.4,100.11) 134.62,100.11 v1(134.28,100.45) ; v1(193.72,83.34) 194.37,83.34 201.69,90.65 v1(206.84,90.65)
  Bottom Layer w0.127: v1(193.72,83.34) 191.17,80.79 191.17,79.96 187.79,76.59 185.5,76.59 180.23,71.31 180.23,68.83 181.64,67.42 181.64,60.11 179.96,58.43 v1(174.47,58.43) ; v1(209.4,100.11) 209.4,92.23 207.82,90.65 v1(206.84,90.65) ; v1(47.55,58.93) 45.47,61.01 45.47,64.13 ; U5.4 129.77,100.96 130.9,99.83 130.9,98.69 RN7.7 132.85,98.69 132.85,100.45 v1(134.28,100.45)
$3N18323: length 229
  Top Layer w0.127: v1(132.88,102.99) 131.77,104.1 v1(117.5,104.1)
  Bottom Layer w0.127: v1(117.5,104.1) 117.5,107.83 115.47,109.85 104.78,109.85 103.39,111.25 96.06,111.25 94.79,109.98 86.9,109.98 85.63,111.25 78.01,111.25 75.98,109.22 67.22,109.22 65.31,111.12 57.94,111.12 56.29,109.47 47.28,109.47 45.62,111.12 37.76,111.12 37.38,111.5 25.43,111.5 6.64,92.71 6.64,84.71 13.75,77.59 58.07,77.59 64.52,71.15 64.52,64.13 ; 131.95,102.23 132.12,102.23 v1(132.88,102.99) ; 131.95,102.23 RN7.8 ; 131.95,102.23 U5.3
$3N18332: length 79.5
  Top Layer w0.127: v1(171.23,60.45) 174.04,60.45 177.2,63.61 177.2,65.37 v1(177.94,66.11) ; v1(176.62,87.4) 176.62,92.04 v1(176.55,92.11)
  Bottom Layer w0.127: v1(171.23,60.45) 169.25,58.47 158.18,58.47 145.42,45.7 SW49.2 ; v1(176.62,87.4) 177.58,86.44 177.58,85.41 181.84,81.14 181.84,79.96 177.94,76.05 v1(177.94,66.11) ; v1(176.55,92.11) 176.55,96.2 178.39,98.04 178.72,98.04
$3N18334: length 68.6
  Top Layer w0.127: v1(181.8,92.11) 181.8,90.52 178.59,87.31 178.59,85.97 175.29,82.67 v1(172.62,82.67)
  Bottom Layer w0.127: SW51.2 183.52,47.67 172.09,59.1 172.09,61.52 167.68,65.93 167.68,76.83 172.24,81.39 172.24,82.29 v1(172.62,82.67) ; v1(181.8,92.11) 182.31,92.61 182.31,98.57 181.41,98.57
$3N18335: length 87.5
  Top Layer w0.127: v1(179.23,92.11) 177.9,90.77 177.9,85.78 175.93,83.82 v1(175.67,83.82)
  Bottom Layer w0.127: v1(175.67,83.82) 175.07,83.82 168.37,77.12 168.37,66.73 173.01,62.1 173.01,58.97 175.93,56.05 191.6,56.05 SW52.2 ; 180.51,99.37 180.51,100.38 179.04,101.85 178.72,101.85 ; 180.51,99.37 181.41,99.37 ; 180.51,99.37 180.35,99.21 180.35,93.23 v1(179.23,92.11)
$3N18337: length 87
  Top Layer w0.127: v1(190.01,92.22) 190.02,92.21 v1(190.02,87.5) ; v1(220.12,75.18) v1(199.62,75.18)
  Bottom Layer w0.127: v1(220.12,75.18) 220.12,55.56 221.62,54.07 SW53.2 ; RN14.5 188.15,104.07 188.15,94.08 v1(190.01,92.22) ; v1(190.02,87.5) 190.02,85.98 191.92,84.08 193.89,84.08 195.71,82.26 195.71,79.1 v1(199.62,75.18)
$3N18338: length 119.5
  Top Layer w0.127: v1(185.43,92.11) 187.46,90.07 187.46,81.29 v1(187.84,80.9) ; v1(234.44,55.9) 184.09,55.9 v1(180.31,59.69)
  Bottom Layer w0.127: v1(180.31,59.69) 180.8,60.19 180.8,66 179.08,67.72 179.08,72.14 v1(187.84,80.9) ; RN14.6 186.26,103.27 186.26,92.95 v1(185.43,92.11) ; v1(234.44,55.9) 240.67,49.68 SW54.2
$3N18346: length 108.3
  Top Layer w0.127: v1(81.63,75.79) 82.91,74.5 103.32,74.5 104.77,73.05 v1(104.77,69.92) ; v1(76.23,95.5) 74.83,94.1 74.83,80.9 v1(75.22,80.51)
  Bottom Layer w0.127: U9.3 79.48,101.72 76.23,98.47 v1(76.23,95.5) ; v1(81.63,75.79) 79.94,75.79 v1(75.22,80.51) ; SW60.2 116.84,32.72 110.75,38.81 110.75,51.34 104.77,57.31 v1(104.77,69.92)
$3N18348: length 170.3
  Top Layer w0.127: v1(65.82,94.61) 66.31,95.1 v1(67.95,95.1) ; v1(57.94,80.9) 57.94,79.26 58.82,78.38 74.22,78.38 76.11,80.26 v1(76.11,80.51) ; v1(67.09,71.75) v1(63.02,75.82)
  Bottom Layer w0.127: v1(57.94,80.9) 57.94,79.12 61.25,75.82 v1(63.02,75.82) ; v1(67.95,95.1) 72.76,99.91 72.76,100.47 74.01,101.72 U9.14 ; v1(67.09,71.75) 67.45,71.39 91.7,71.39 92.29,70.8 117.85,70.8 125.26,63.39 125.26,54.75 128.08,51.93 128.08,38.36 135.89,30.55 SW61.2 ; v1(65.82,94.61) 65.82,93.6 67.74,91.67 70.42,91.67 76.11,85.99 v1(76.11,80.51)
$3N18354: length 145.1
  Top Layer w0.127: v1(164.12,79.39) 163.96,79.55 163.96,80.56 158.85,85.67 158.85,90.66 v1(157.52,91.99) ; v1(165.51,63.5) 170.85,63.5 v1(172.37,61.97)
  Bottom Layer w0.127: v1(172.37,61.97) 172.37,59.21 177.5,54.08 185.61,54.08 197.24,42.46 197.24,39.02 203.23,33.03 205.09,33.03 SW65.2 ; v1(157.52,91.99) 159.33,90.18 193,90.18 197.89,95.07 RN17.5 ; v1(165.51,63.5) v1(162.47,63.5) 162.47,77.73 v1(164.12,79.39)
$3N18355: length 117.5
  Top Layer w0.127: v1(208.47,92.22) 208.25,91.99 v1(208.25,78.99)
  Bottom Layer w0.127: v1(208.47,92.22) 201.25,92.22 198.79,94.68 198.79,97.13 RN17.6 196.84,97.13 196.84,94.58 194.89,92.62 192.93,94.58 192.93,97.75 194.88,99.69 U10.5 ; SW66.2 221.53,35.77 212.14,35.77 204.66,43.25 204.66,55.95 200.07,60.54 200.07,65.68 208.25,73.86 v1(208.25,78.99)
$3N18356: length 140.8
  Top Layer w0.127: v1(199.76,104.17) 200.65,103.28 227.92,103.28 v1(229.18,104.55) ; v1(235.53,90.65) 235.53,83.73 v1(235.49,83.69)
  Bottom Layer w0.127: v1(199.76,104.17) 198.79,103.2 198.79,97.93 RN17.7 196.84,97.93 196.84,99.64 195.52,100.96 U10.4 ; v1(235.53,90.65) 231.29,90.65 229.18,92.76 v1(229.18,104.55) ; SW67.2 266.83,27.93 248.52,46.24 248.52,61.64 244.38,65.78 244.38,67.81 243.49,68.7 241.21,68.7 238.66,71.25 238.66,80.65 235.62,83.69 v1(235.49,83.69)
$3N18357: length 217.4
  Top Layer w0.127: v1(326.17,105.79) 324.95,107.01 237.68,107.01 232.76,102.08 v1(196.84,102.08)
  Bottom Layer w0.127: 196.84,102.23 U10.3 ; 196.84,102.23 v1(196.84,102.08) ; 196.84,102.23 197.89,101.18 RN17.8 ; v1(326.17,105.79) 326.17,26.25 SW68.2
$3N18359: length 339
  Top Layer w0.127: v1(203.6,108.74) 203.6,115.2 196.39,122.41 v1(13.98,122.41)
  Bottom Layer w0.127: 19.31,6.98 19.31,9.55 1.18,27.68 1.18,121.32 2.27,122.41 v1(13.98,122.41) ; v1(203.6,108.74) 203.65,108.69 RN18.5
$3N18360: length 365
  Top Layer w0.127: v1(208.88,109.6) 208.88,110.48 196.16,123.2 3.97,123.2 v1(1.99,121.22)
  Bottom Layer w0.127: v1(1.99,121.22) 1.76,120.99 1.76,48.55 11.77,38.54 22.41,38.54 43.05,17.89 43.05,6.98 ; v1(208.88,109.6) 202.75,109.6 202.75,103.14 RN18.6
$3N18374: length 156.1
  Top Layer w0.127: v1(36.9,102.93) 35.81,101.83 v1(25.34,101.83) ; v1(56.47,99.93) 55.88,100.51 29.2,100.51 v1(28.73,100.04) ; v1(113.06,77.47) 112.81,77.21 39.78,77.21 38.89,78.1 v1(38.89,78.99)
  Bottom Layer w0.127: U3.13 38.89,100.58 ; 38.89,100.58 36.9,102.57 v1(36.9,102.93) ; 38.89,100.58 v1(38.89,78.99) ; v1(25.34,101.83) 26.94,101.83 v1(28.73,100.04) ; SW14.2 113.06,82.26 v1(113.06,77.47) ; v1(56.47,99.93) 56.47,98.76 55.39,97.68 RN4.6
$3N18375: length 97.1
  Top Layer w0.127: v1(55.43,102.06) 38.91,102.06 v1(38.2,102.76)
  Bottom Layer w0.127: RN4.5 55.16,101.79 v1(55.43,102.06) ; SW13.2 84.52,74.61 61.56,74.61 56.71,79.46 56.71,84.32 52.44,88.59 49.94,88.59 43.16,95.36 43.16,100.38 41.69,101.85 U3.14 39.12,101.85 v1(38.2,102.76)
$3N18376: length 111.3
  Top Layer w0.127: v1(59.59,93.72) 59.72,93.85 v1(66.83,93.85)
  Bottom Layer w0.127: v1(59.59,93.72) 57.52,93.72 RN4.8 ; v1(66.83,93.85) 68.73,91.95 70.54,91.95 74.28,88.2 90.92,88.2 94.81,84.32 94.81,78 98.2,74.61 141.68,74.61 150.24,83.17 SW16.2
$3N18377: length 62
  Top Layer w0.127: 58,94.63 v1(53.39,94.63) ; 58,94.63 62.37,94.63 v1(62.52,94.48) ; 58,94.63 v1(58,93.45)
  Bottom Layer w0.127: U3.3 46.52,101.85 45.04,100.38 45.04,95.71 48.62,92.13 56.68,92.13 v1(58,93.45) ; v1(53.39,94.63) 50.96,97.07 50.96,103.43 RN3.8 ; v1(62.52,94.48) 64.04,94.48 67.22,91.31 70.39,91.31 74.04,87.66 SW12.2
$3N18380: length 44.1
  Top Layer w0.127: v1(49.85,94.83) 39.85,94.83 v1(37.25,92.22)
  Bottom Layer w0.127: RN3.5 49.85,100.82 v1(49.85,94.83) ; 16.89,83.18 23.69,89.98 35,89.98 v1(37.25,92.22)
$3N18388: length 4.5
  Bottom Layer w0.127: RN11.8 164.92,99.81 162.55,102.18 U7.3
$3N18389: length 4.6
  Bottom Layer w0.127: RN11.7 163.87,98.19 163.87,99.59 162.55,100.91 162.23,100.91
$3N18390: length 12.4
  Bottom Layer w0.127: RN11.6 163.87,97.39 163.87,95.8 162.28,94.21 162.03,94.21 160.2,96.05 160.2,97.92 161.91,99.64 U7.5
$3N18396: length 145.4
  Top Layer w0.127: v1(227.4,105.11) 225.64,106.87 154.91,106.87 v1(154.28,106.25) ; v1(215.95,84.07) 215.95,84.33 v1(222.26,90.65)
  Bottom Layer w0.127: v1(227.4,105.11) 222.26,99.98 v1(222.26,90.65) ; v1(154.28,106.25) 155.18,105.35 155.18,97.82 152.26,94.9 151.53,94.9 149.34,97.09 149.34,99.62 RN9.8 146.08,101.98 145.75,101.98 ; 216.92,64.13 218.37,65.58 218.37,81.9 217.16,83.11 216.9,83.11 v1(215.95,84.07)
$3N18397: length 11.9
  Bottom Layer w0.127: 148.44,98.02 147.59,98.02 147.38,97.82 147.38,95.67 146.7,94.99 144.55,94.99 144.18,95.37 144.18,98.29 145.32,99.44 145.75,99.44
$3N18400: length 3.8
  Bottom Layer w0.127: 145.75,100.71 146.44,100.71 147.38,99.76 147.38,99.28 147.84,98.82 RN9.7
$3N18417: length 63.8
  Top Layer w0.127: v1(56.61,96.74) 76.2,96.74 77.48,95.46 v1(77.48,92.7) ; v1(94.69,88.96) 95.92,90.19 95.92,91.03 97.99,93.09 108.5,93.09 v1(108.5,93.71)
  Bottom Layer w0.127: v1(56.61,96.74) 56.76,96.9 U1.10 ; v1(108.5,93.71) 108.5,94.18 U2.9 ; v1(77.48,92.7) 81.22,88.96 v1(94.69,88.96)
$3N18444: length 4.2
  Bottom Layer w0.127: U1.3 64.43,101.98 66.19,100.22 RN22.4
$3N18449: length 151.5
  Bottom Layer w0.127: RN5.8 102.81,98.22 101.89,97.3 101.89,84.32 109.38,76.83 113.82,76.83 116.24,79.24 116.24,82.8 116.36,82.93 117.63,82.93 123.6,88.9 220.73,88.9 SW20.2
$3N18450: length 147.7
  Top Layer w0.127: v1(180.97,71.15) 180.97,71.15 176.34,75.79 v1(97.93,75.79)
  Bottom Layer w0.127: SW19.2 207.39,82.04 196.5,71.15 v1(180.97,71.15) ; v1(97.93,75.79) 97.03,76.69 97.03,86.71 98.6,88.28 98.6,96.49 101.23,99.12 103.86,99.12 103.86,97.42 RN5.7
$3N18455: length 290.4
  Top Layer w0.127: v1(89.12,103.33) 89.94,104.16 v1(102.3,104.16) ; v1(245.44,77.48) 244.93,76.97 v1(160.1,76.97) ; v1(92.48,95.15) 90.32,97.31 58.61,97.31 58.38,97.55 53.67,97.55 51.62,95.5 51.62,95.49 53.66,93.45 55.8,93.45 57.15,92.1 57.15,79.66 59.05,77.76 v1(93.95,77.76)
  Bottom Layer w0.127: v1(93.95,77.76) 100.2,71.5 154.64,71.5 v1(160.1,76.97) ; v1(92.48,95.15) 92.03,94.7 90.16,94.7 89.12,95.74 89.12,101.98 ; 89.12,101.98 U4.14 ; 89.12,101.98 v1(89.12,103.33) ; v1(102.3,104.16) 101.95,103.81 RN6.5 ; v1(245.44,77.48) 245.44,83.13 SW21.2
$3N34287: length 129.3
  Top Layer w0.127: v1(214.3,92.11) 214.01,92.11 v1(212.56,90.65) 212.77,90.44 v1(212.77,87.37)
  Bottom Layer w0.127: RN19.5 214.38,92.18 v1(214.3,92.11) ; v1(212.77,87.37) 209.59,84.19 209.59,70.65 206.47,67.52 206.47,66.29 210.92,61.84 210.92,46.66 215.12,42.47 215.12,40.52 219.17,36.47 224.05,36.47 232.99,27.53 232.99,24.89 225.58,17.49 220.19,17.49 209.68,6.98 ; v1(212.56,90.65) 210.11,93.1 210.11,97.05 211.36,98.29 U11.6
$3N34288: length 105.5
  Top Layer w0.127: v1(219.69,82.36) 219.17,82.87 216.23,82.87 215.2,83.9 215.2,89.32 v1(213.87,90.65)
  Bottom Layer w0.127: 214.38,97.26 213.32,97.26 213.32,91.2 v1(213.87,90.65) ; 233.55,6.98 235.49,8.92 235.49,34.79 232.31,37.97 228.12,37.97 224.29,41.81 224.29,62.88 221.21,65.96 221.21,80.84 v1(219.69,82.36)
$3N34289: length 190.1
  Top Layer w0.127: v1(239.04,103.1) 237.28,101.34 v1(209.58,101.34) ; v1(234.47,84.2) 234.47,90.51 236.07,92.11 v1(237.55,92.11)
  Bottom Layer w0.127: v1(239.04,103.1) 237.55,101.61 v1(237.55,92.11) ; v1(234.47,84.2) 231.43,84.2 229.79,82.56 229.79,75.54 228.13,75.54 226.47,77.2 226.47,80.72 223.96,80.72 223.96,70.18 225.52,70.18 225.52,64.06 229.47,64.06 229.47,52.03 225.21,52.03 225.21,41.74 228.37,38.58 233.36,38.58 238.9,33.03 238.9,16.58 252.59,2.9 254.05,2.9 257.3,6.14 257.3,6.98 ; RN19.7 213.32,98.06 213.32,99.52 212.01,100.83 U11.4 209.96,100.83 209.58,101.22 v1(209.58,101.34)
$3N34290: length 146
  Top Layer w0.127: v1(216.21,92.11) 221.73,92.11 225.54,88.29 v1(225.54,79.23)
  Bottom Layer w0.127: SW84.2 281.81,17.17 279.56,19.43 252.51,19.43 247.17,24.76 247.17,53.58 240.99,59.76 240.59,59.76 237.89,62.47 237.89,66.93 231.72,73.1 230.01,73.1 225.54,77.57 v1(225.54,79.23) ; v1(216.21,92.11) 215.28,93.04 215.28,98.86 RN19.8 214.38,99.73 212.01,102.1 U11.3
$3N34292: length 185.2
  Top Layer w0.127: v1(227.4,92.34) 227.64,92.1 230.75,92.1 230.75,92.77 231.42,93.43 280.95,93.43 v1(289.07,85.32)
  Bottom Layer w0.127: 307.34,6.98 307.34,6.14 304.09,2.9 302.63,2.9 289.07,16.46 v1(289.07,85.32) ; RN20.5 224.28,107.83 225.6,107.83 228.29,105.13 228.29,93.23 v1(227.4,92.34)
$3N34293: length 190.7
  Top Layer w0.127: v1(323.15,19.05) 321.25,17.15 v1(287.34,17.15) ; v1(242.29,90.65) 241.2,89.55 v1(241.2,85.4) ; v1(241.46,101.2) 240.45,100.19 v1(221.34,100.19)
  Bottom Layer w0.127: 326.39,6.98 326.39,15.81 v1(323.15,19.05) ; v1(287.34,17.15) 287.34,58.41 270.57,75.18 258.46,75.18 252.46,81.19 252.46,81.56 246.83,87.19 242.99,87.19 v1(241.2,85.4) ; RN20.6 220.29,102.89 221.34,101.84 v1(221.34,100.19) ; v1(242.29,90.65) 242.29,100.37 v1(241.46,101.2)
